# Altium schematic sheet sunjiangzheng.SchDoc
size A4
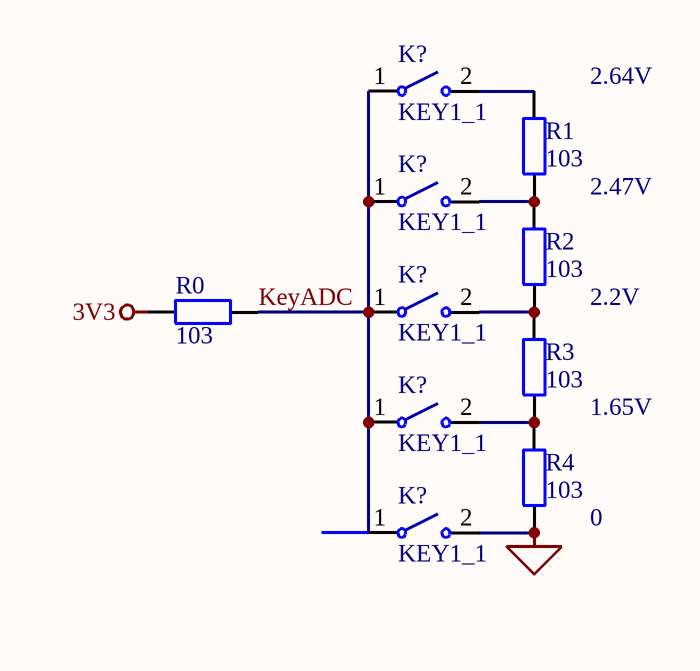
[diagram p0: sunjiangzheng.SchDoc]

## Parts
(Parts that share a designator on the sheet are numbered #1, #2 ... from top to bottom, then left to right.)
K?#1  KEY1_1
K?#2  KEY1_1
K?#3  KEY1_1
K?#4  KEY1_1
K?#5  KEY1_1
R0  103  [R0603]
R1  103  [R0603]
R2  103  [R0603]
R3  103  [R0603]
R4  103  [R0603]

## Nets
3V3: R0.1
GND: K?#5.2 R4.2
KeyADC: K?#1.1 K?#2.1 K?#3.1 K?#4.1 K?#5.1 R0.2
NetK?#1_2: K?#1.2 R1.1
NetK?#2_2: K?#2.2 R1.2 R2.1
NetK?#3_2: K?#3.2 R2.2 R3.1
NetK?#4_2: K?#4.2 R3.2 R4.1

## Notes on the sheet
- (near R1) 2.64V
- 2.47V
- 2.2V
- 1.65V
- (near R4) 0

## Library data of the parts
R0-R4 = Res2: 贴片电阻; Manufacturer: Generic Components; Class: Passive; SubClass: Resistor; Value: 15K; Published: 08/06/2000; Publisher: Altium Hobart Technology Centre